# EAGLE design Sensore (EAGLE 7.0.0)
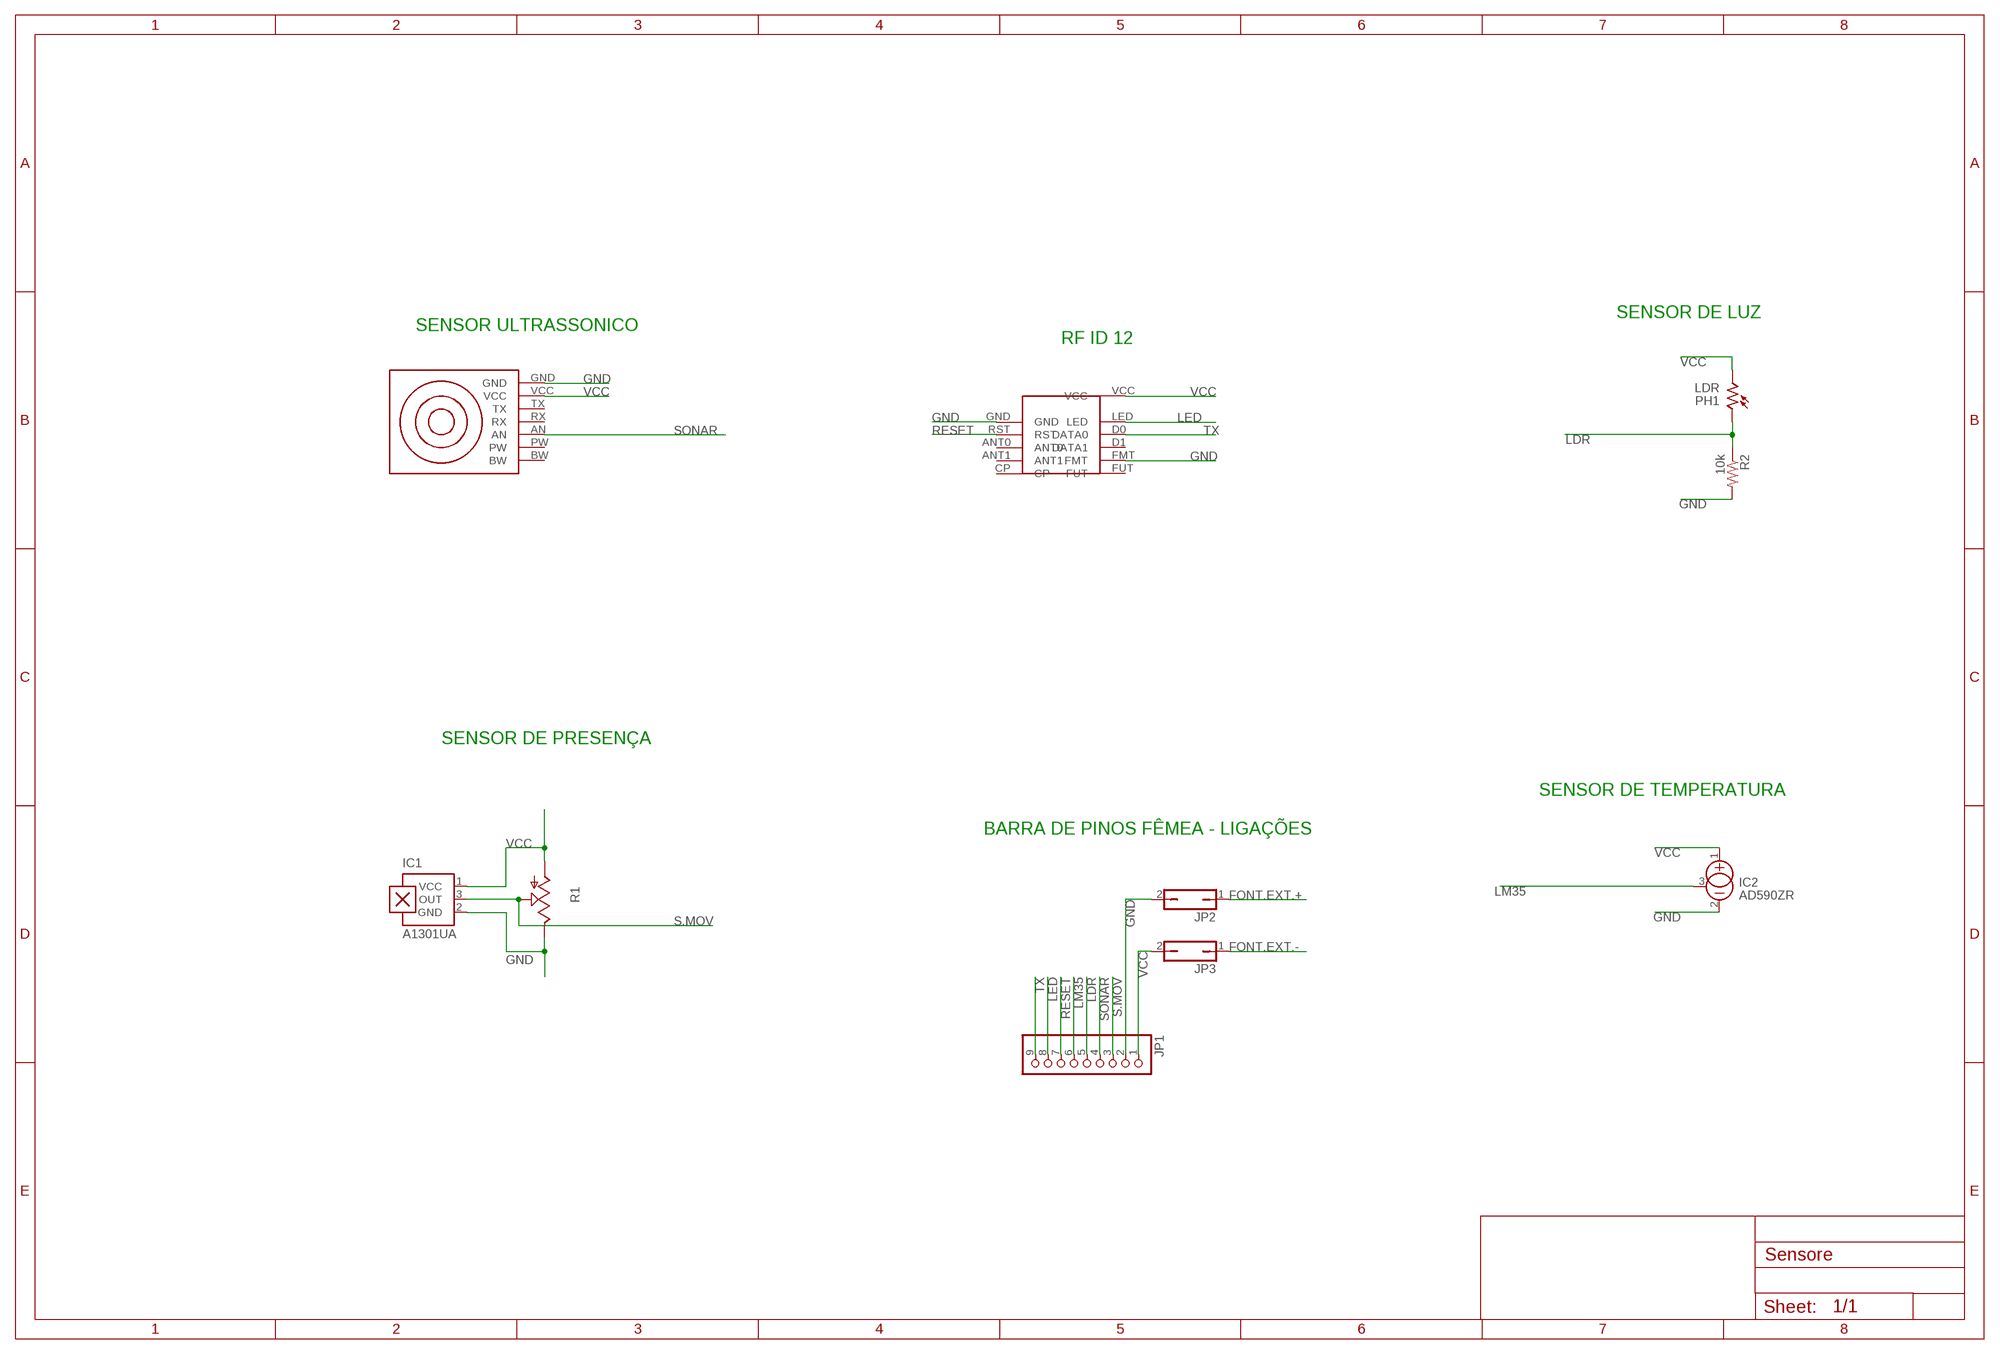
[diagram p0: schematic, sheet 1]

## Parts
IC1  A1301UA  [SIP3-UA]
IC2  AD590ZR  [TO92]
JP1  PINHD-1X9  [1X09]
JP2  JP1Q  [JP1]
JP3  JP1Q  [JP1]
PH1  LDR  A1050_09  [T0-46-A10XX]
R1  TRIM_US-CIP20C-6MM  [CIP20C-6MM]
R2  10k  R-US_0207/10  [0207/10]
U$1  LV-EZ1  [LV-EZ1]
U$2  RFID12  [RFID12]

## Nets
FONT.EXT.+: JP2.1
FONT.EXT.-: JP3.1
GND: IC1.2(GND) IC2.2(-) JP1.2 JP2.2 R1.E R2.2 U$1.GND U$2.FMT U$2.GND
LDR: JP1.5 PH1.1 R2.1
LED: JP1.8 U$2.LED
LM35: IC2.3(CAN) JP1.6
RESET: JP1.7 U$2.RST
S.MOV: IC1.3(OUT) JP1.3 R1.S
SONAR: JP1.4 U$1.AN
TX: JP1.9 U$2.D0(DATA0)
VCC: IC1.1(VCC) IC2.1(+) JP1.1 JP3.2 PH1.2 R1.A U$1.VCC U$2.VCC
Unconnected: U$1.BW U$1.PW U$1.RX U$1.TX U$2.ANT0 U$2.ANT1 U$2.CP U$2.D1(DATA1) U$2.FUT

## Notes on the sheet
- SENSOR DE LUZ
- SENSOR ULTRASSONICO
- RF ID 12
- SENSOR DE PRESENÇA
- SENSOR DE TEMPERATURA
- BARRA DE PINOS FÊMEA - LIGAÇÕES

## Library data of the parts
IC1 = allegro:A13*?: Linear Hall Effect Sensor ICs Continuous-Time Ratiometric High-Temperature Operation Programmable Linear with Analog Output A1302 -Replacement- UGN3503 Source: http://www.allegromicro.com/en/Products/Part_Numbers/1301/1301.pdf http://www.allegromicro.com/en/Products/Part_Numbers/1321/1321.pdf http://www.allegromicro.com/en/Products/Part_Numbers/1381/1381.pdf; MF: ALLEGRO MICROSYSTEMS, INC.; MPN: A1301EUA-T; OC_FARNELL: 1198085; OC_NEWARK: 31K6635
IC2 = linear:AD590ZR: TEMPERATURE SENSOR current output
JP1 = pinhead:PINHD-1X9: PIN HEADER
JP2 JP3 = jumper:JP1Q: JUMPER
PH1 = photo-elements:A10: Sensor Robust Light Sensing Applications Outdoor Light Sensing Application Source: http://optoelectronics.perkinelmer.com/content/Datasheets/DTS_PhotocellsA1050.pdf
R1 = pot:TRIM_US-: POTENTIOMETER
R2 = rcl:R-US_: RESISTOR, American symbol
U$1 = Componentes:LV-EZ1
U$2 = Componentes:RFID12

## Board
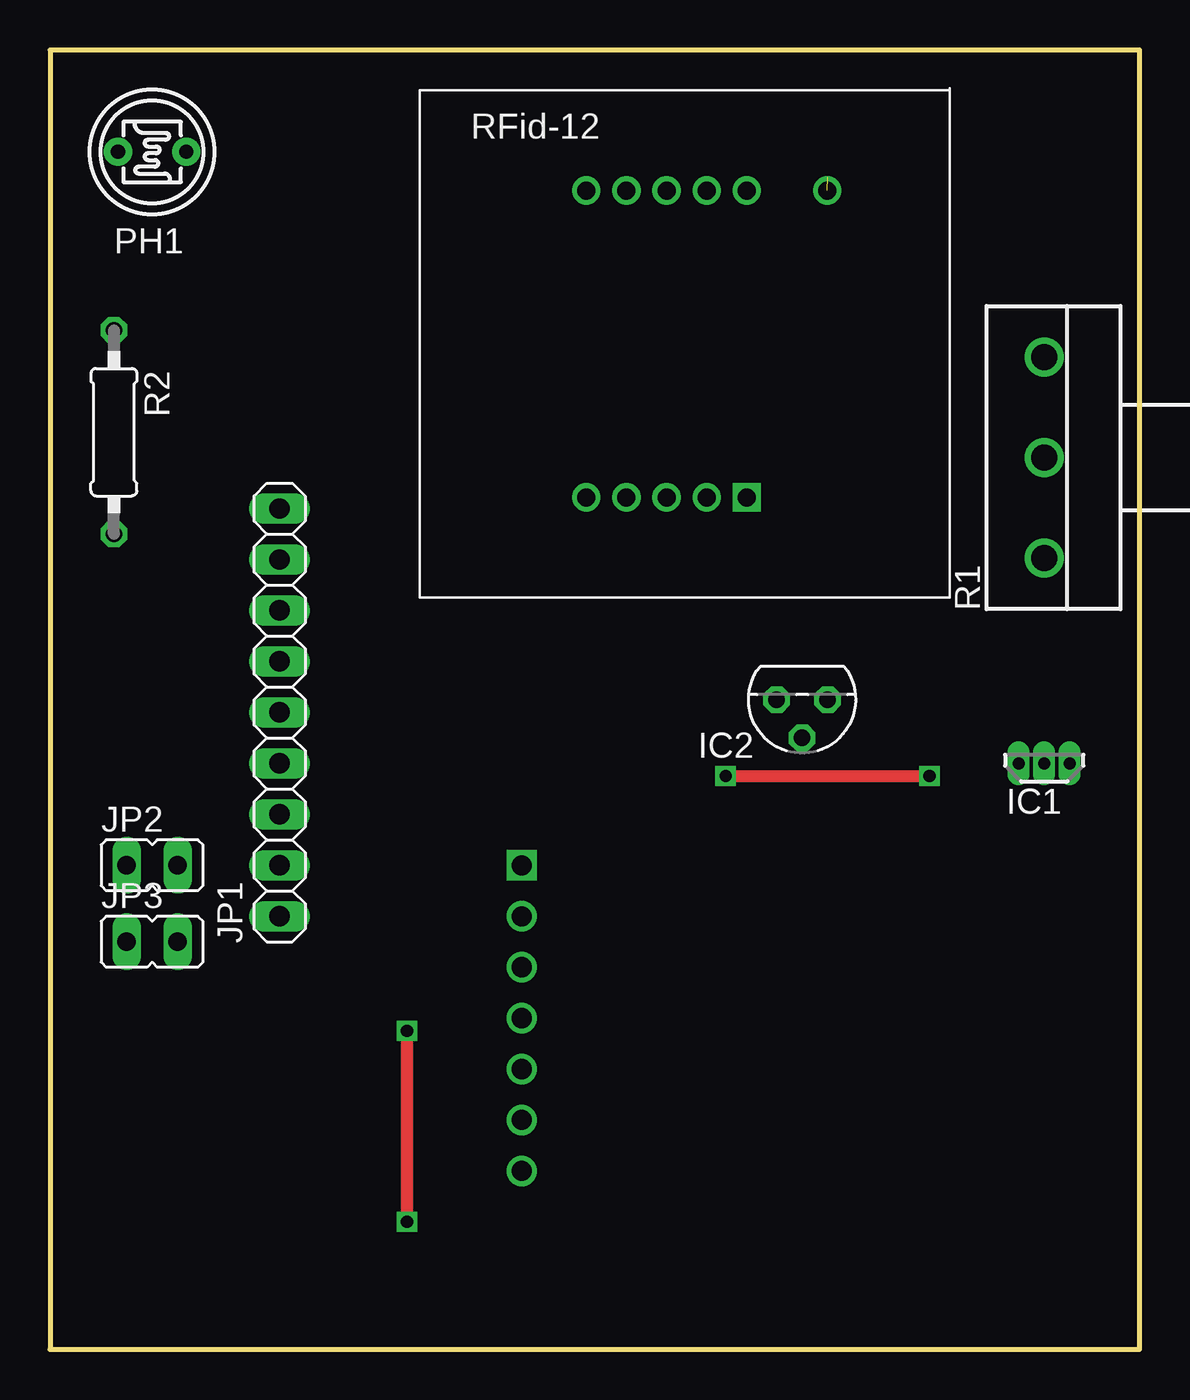
[diagram p1: board, top side]
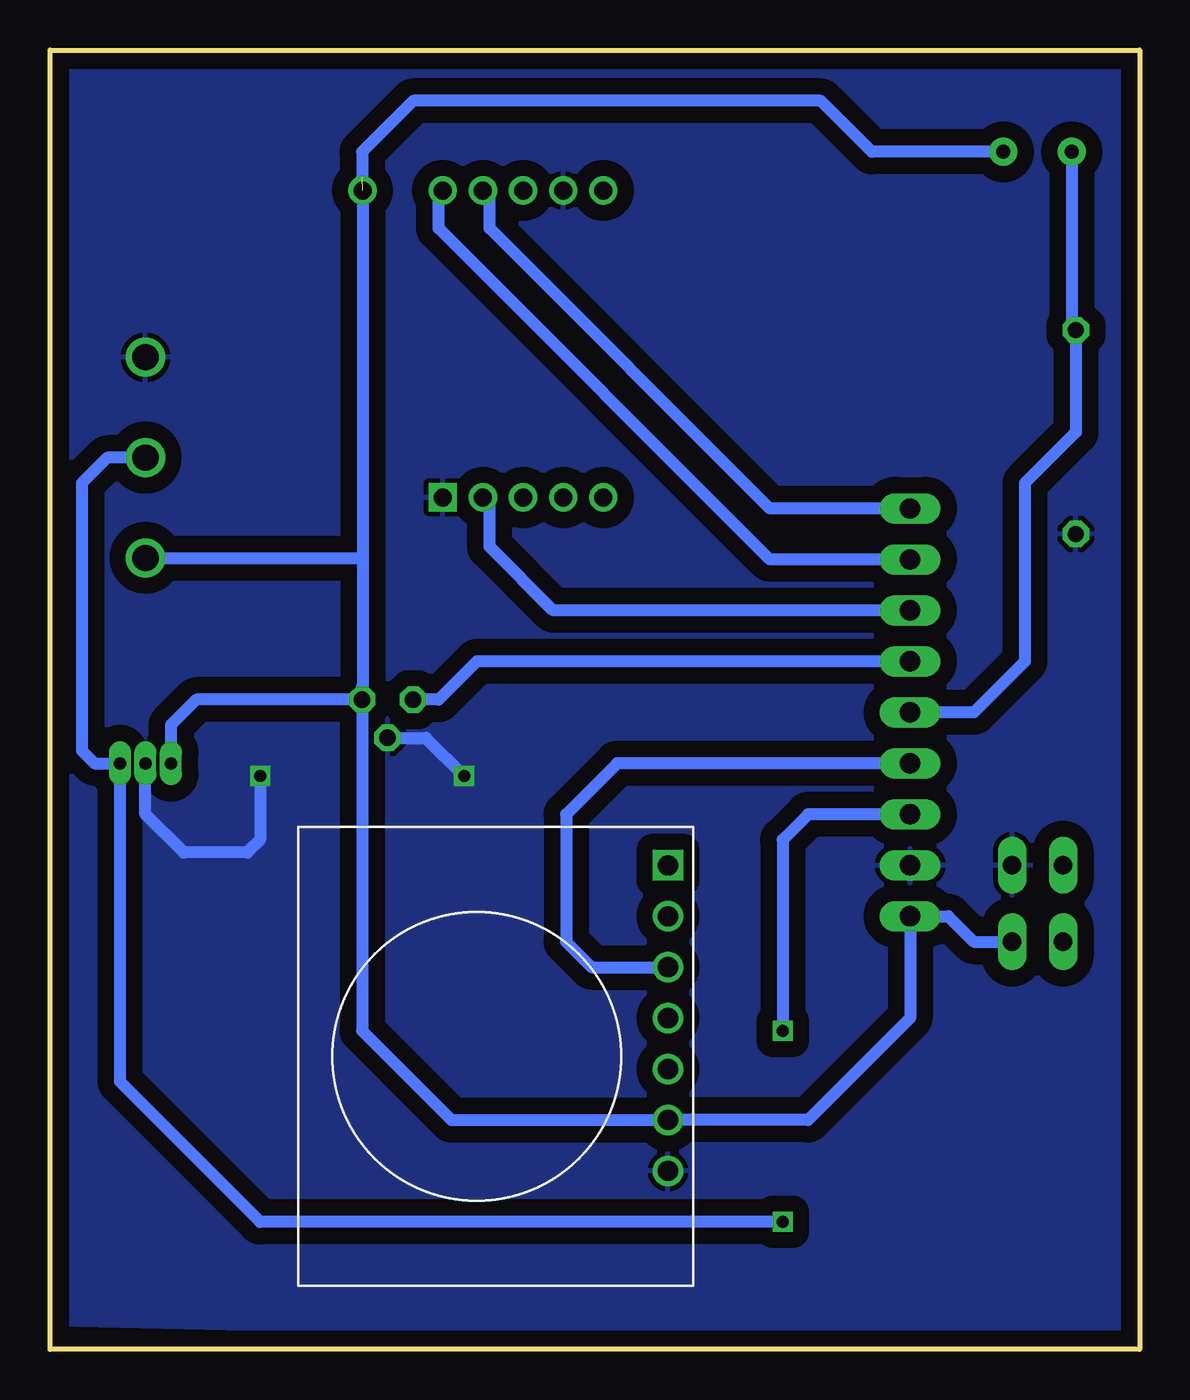
[diagram p2: board, bottom side, seen from below]

Size 54.28 x 64.76 mm. Coordinates in mm from the lower left corner, seen from the top.
Outline: 0,0 54.28,0 54.28,64.76 0,64.76 0,0
Copper layers (1*16): Top 0.035mm / dielectric 1.5mm / Bottom 0.035mm
Design rules "default *": minimum track width 10mil, minimum drill 24mil, track to track 12mil, track to pad 12mil, pad to pad 12mil, via to via 12mil, smd to smd 8mil, copper to edge 16mil, drill to drill 8mil, minimum pad ring 10mil, minimum via ring 8mil, stop-mask expansion 4mil, vias tented up to drill 0mil, thermal gap 10mil

### Footprints (pad centres in the part's own frame; a part is rotated, then mirrored left to right if it is on the bottom)
SIP3-UA = drill 0.6 pad 0.7 long: 1 -1.27,0; 2 0,0; 3 1.27,0
TO92 = drill 0.813 octagon: 1 -1.27,0; 2 0,1.905; 3 1.27,0
1X09 = drill 1.016 long: 1 -10.16,0; 2 -7.62,0; 3 -5.08,0; 4 -2.54,0; 5 0,0; 6 2.54,0; 7 5.08,0; 8 7.62,0; 9 10.16,0
JP1 = drill 0.914 long: 1 0,-1.27; 2 0,1.27
T0-46-A10XX = drill 0.7 pad 1.4: 1 -1.7,0; 2 1.7,0
CIP20C-6MM = drill 1.3 pad 1.93: A -5,0; E 5,0; S 0,0
0207/10 = drill 0.813 octagon: 1 -5.08,0; 2 5.08,0
LV-EZ1 = drill 1: AN 9.525,-4.445; GND 9.525,5.715; PW 9.525,-6.985; RX 9.525,-1.905; TX 9.525,0.635; VCC 9.525,3.175 | drill 1 square: BW 9.525,-9.525
RFID12 = drill 0.9: ANT0 12.3,5; ANT1 10.3,5; CP 8.3,5; D0 14.3,20.3; D1 12.3,20.3; FMT 10.3,20.3; FUT 8.3,20.3; LED 16.3,20.3; RST 14.3,5; VCC 20.3,20.3 | drill 0.9 square: GND 16.3,5

### Placement (x,y rotation side)
IC1  49.53,29.21 0 top
IC2  37.47,32.38 180 top
JP1  11.43,31.75 90 top
JP2  5.08,24.13 270 top
JP3  5.08,20.32 270 top
PH1  5.08,59.69 0 top
R1  49.53,44.45 90 top
R2  3.17,45.72 270 top
U$1  33.02,14.61 180 top
U$2  18.41,37.47 0 top

### Tracks (layer width: path | path; a pad name or v marks a point on that pad's centre or on a via)
GND  (via drill 0.6)
  Top 0.61: v33.66,28.57 v43.81,28.57
  Bottom 0.61: IC2.2 35.56,30.48 v33.66,28.57 | v43.81,28.57 43.81,25.4 44.45,24.77 47.62,24.77 49.53,26.67 IC1.2
  pour Bottom (isolate 0.813): 0,64.77 53.98,66.04 53.98,1.27 0,0
LDR
  Bottom 0.61: PH1.1 3.38,51.01 R2.1 3.17,45.72 5.71,43.18 5.71,34.29 8.26,31.75 JP1.5
LED
  Bottom 0.61: JP1.8 18.41,39.37 34.92,55.88 34.92,57.55 U$2.LED
LM35
  Bottom 0.61: JP1.6 33.02,34.29 34.92,32.38 IC2.3
RESET
  Bottom 0.61: JP1.7 29.21,36.83 32.38,40.01 32.38,42.13 U$2.RST
S.MOV  (via drill 0.6)
  Top 0.61: v17.78,15.88 v17.78,6.35
  Bottom 0.61: R1.S 51.44,44.45 52.7,43.18 52.7,29.84 52.07,29.21 IC1.3 50.8,13.34 43.81,6.35 v17.78,6.35 | JP1.3 16.51,26.67 17.78,25.4 v17.78,15.88
SONAR
  Bottom 0.61: JP1.4 26.04,29.21 28.57,26.67 28.57,20.32 27.3,19.05 U$1.AN
TX
  Bottom 0.61: JP1.9 18.41,41.91 32.38,55.88 32.38,57.44 U$2.D0
VCC  (1 unrouted)
  Bottom 0.61: U$2.VCC 38.72,39.37 | 38.72,39.37 38.72,33.04 38.73,33.02 IC2.1 | IC2.1 38.73,15.88 34.29,11.43 U$1.VCC 16.51,11.43 11.43,16.51 JP1.1 9.53,21.59 8.26,20.32 JP3.2 | PH1.2 13.34,59.69 15.88,62.23 36.2,62.23 38.73,59.69 38.73,58.42 | R1.A 38.8,39.45 38.72,39.37 | IC2.1 46.99,32.38 48.26,31.11 IC1.1